# EAGLE design AP_board (EAGLE 9.2.2)
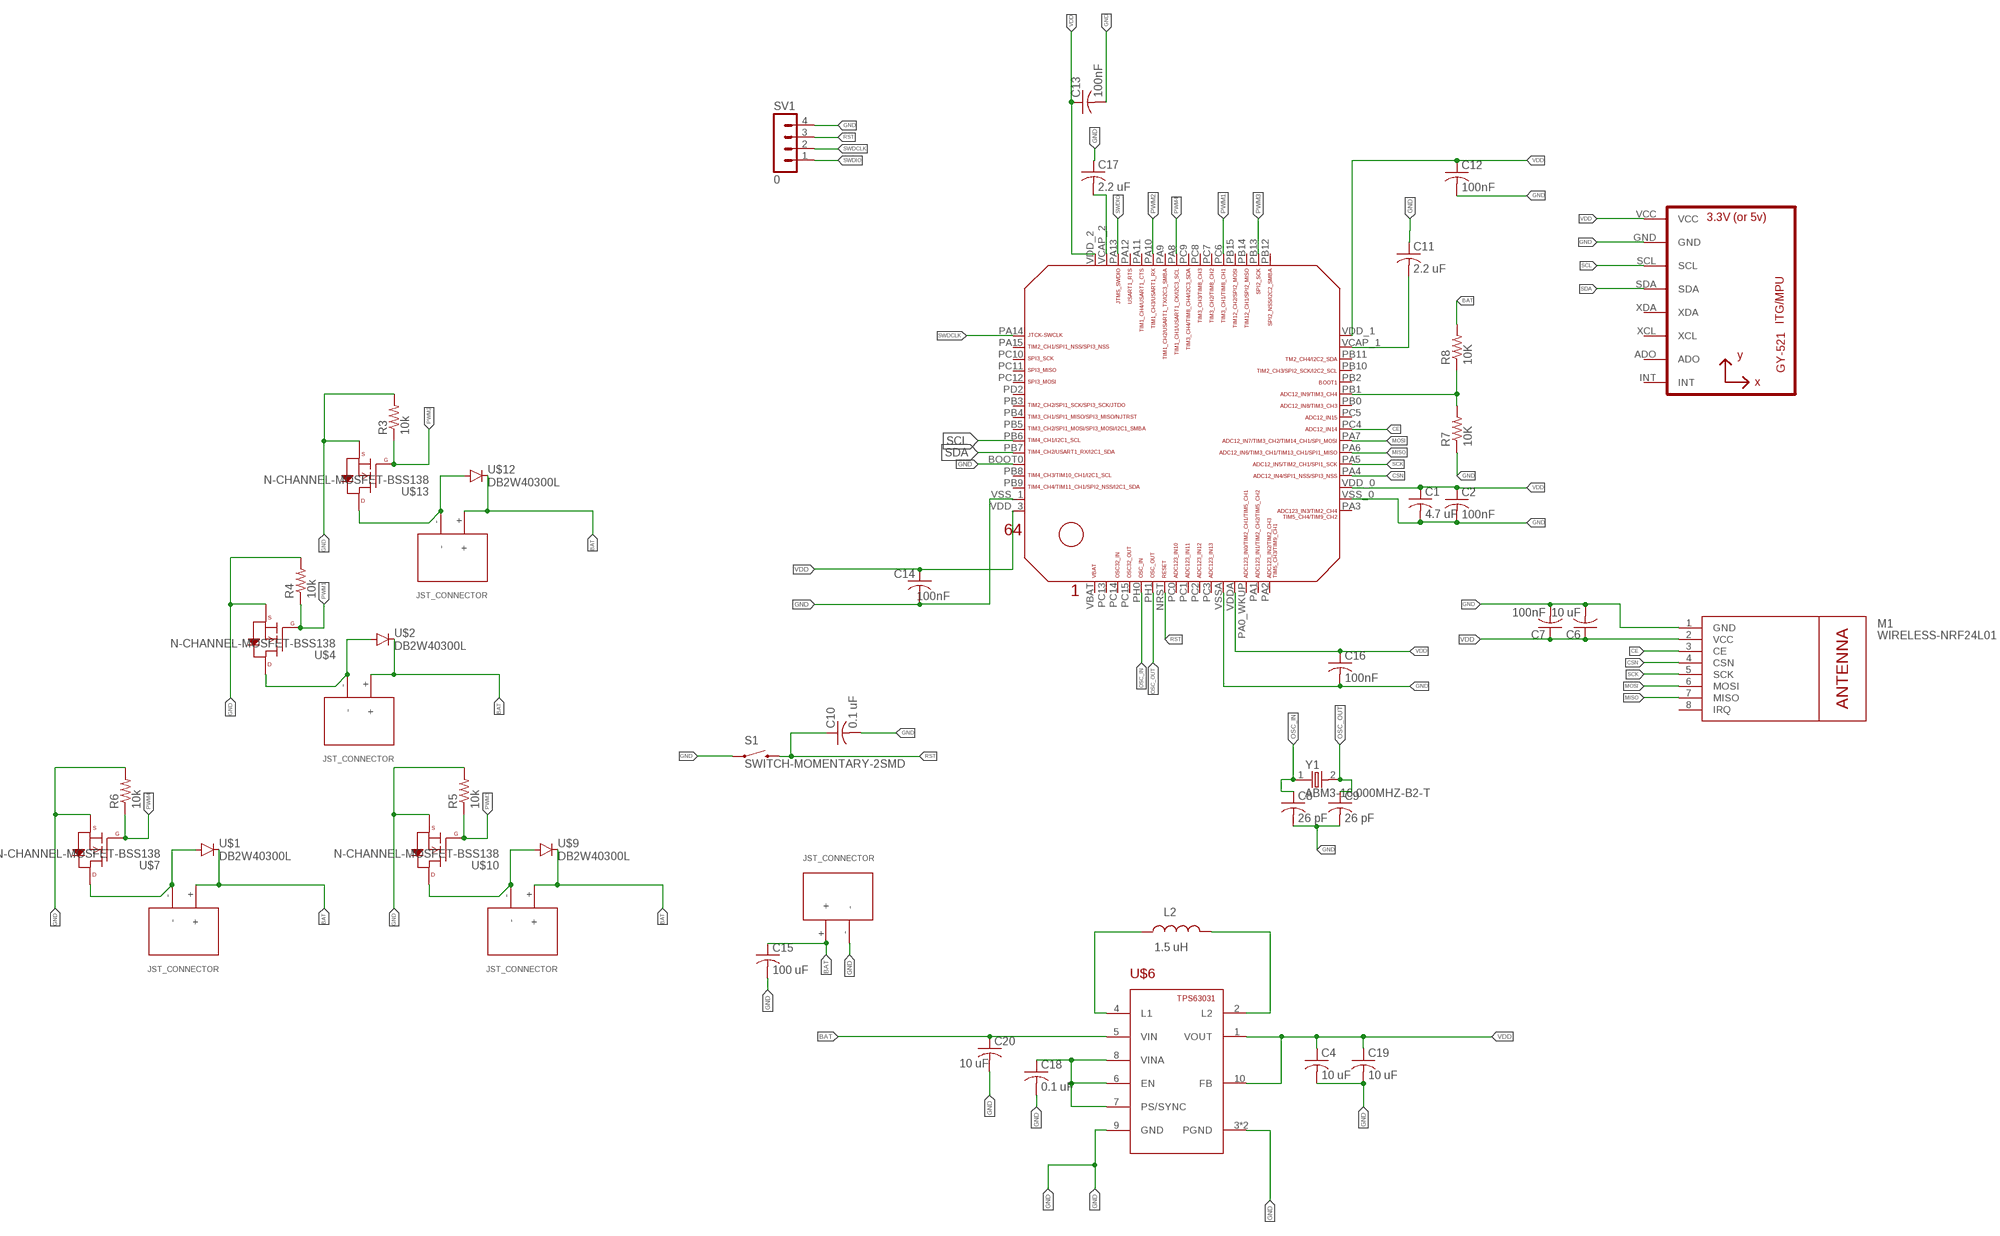
[diagram p0: schematic, sheet 1]

## Parts
C1  4.7 uF  C-USC0603  [C0603]
C2  100nF  C-USC0603  [C0603]
C4  10 uF  C-USC0603  [C0603]
C6  10 uF  C-USC0603  [C0603]
C7  100nF  C-USC0603  [C0603]
C8  26 pF  C-USC0603  [C0603]
C9  26 pF  C-USC0603  [C0603]
C10  0.1 uF  C-USC0603  [C0603]
C11  2.2 uF  C-USC0603  [C0603]
C12  100nF  C-USC0603  [C0603]
C13  100nF  C-USC0603  [C0603]
C14  100nF  C-USC0603  [C0603]
C15  100 uF  C-USC1206  [C1206]
C16  100nF  C-USC0603  [C0603]
C17  2.2 uF  C-USC0603  [C0603]
C18  0.1 uF  C-USC0603  [C0603]
C19  10 uF  C-USC0603  [C0603]
C20  10 uF  C-USC0603  [C0603]
L2  1.5 uH  INDUCTOR  [IND1212]
M1  WIRELESS-NRF24L01  [WIRELESS-NRF24L01]
R3  10k  R-US_R0603  [R0603]
R4  10k  R-US_R0603  [R0603]
R5  10k  R-US_R0603  [R0603]
R6  10k  R-US_R0603  [R0603]
R7  10K  R-US_R0603  [R0603]
R8  10K  R-US_R0603  [R0603]
S1  SWITCH-MOMENTARY-2SMD  [TACTILE-SWITCH-SMD]
SV1  0  MA04-1  [MA04-1]
U1  GY-521MPU6050  [GY-521]
U$1  DB2W40300L  [MINI2-F3-B]
U$2  DB2W40300L  [MINI2-F3-B]
U$3  STM32F405/415_LQFP64  [STM32F405/415_LQFP64]
U$4  N-CHANNEL-MOSFET-BSS138  [SOT23-3]
U$5  JST_CONNECTOR_FEMALE  [JST_CONNECTOR_FEMALE]
U$6  TPS63031  [SON-10]
U$7  N-CHANNEL-MOSFET-BSS138  [SOT23-3]
U$8  JST_CONNECTOR_FEMALE  [JST_CONNECTOR_FEMALE]
U$9  DB2W40300L  [MINI2-F3-B]
U$10  N-CHANNEL-MOSFET-BSS138  [SOT23-3]
U$11  JST_CONNECTOR_FEMALE  [JST_CONNECTOR_FEMALE]
U$12  DB2W40300L  [MINI2-F3-B]
U$13  N-CHANNEL-MOSFET-BSS138  [SOT23-3]
U$14  JST_CONNECTOR_FEMALE  [JST_CONNECTOR_FEMALE]
U$17  JST_CONNECTOR_FEMALE  [JST_CONNECTOR_FEMALE]
Y1  ABM3-16.000MHZ-B2-T  [XTAL500X320X130N]

## Nets
BAT: C15.1 C20.1 R8.2 U$1.NEG(GPIN) U$2.NEG(GPIN) U$5.+ U$6.5(VIN) U$8.+ U$9.NEG(GPIN) U$11.+ U$12.NEG(GPIN) U$14.+ U$17.+
CE: M1.3(CE) U$3.PC4
CSN: M1.4(CSN) U$3.PA4
GND: C1.2 C2.2 C4.2 C6.2 C7.2 C8.2 C9.2 C10.2 C11.1 C12.2 C13.2 C14.2 C15.2 C16.2 C17.1 C18.2 C19.2 C20.2 M1.1(GND) R3.2 R4.2 R5.2 R6.2 R7.1 S1.1 SV1.4 U1.GND U$3.BOOT0 U$3.VSS_0 U$3.VSS_1 U$3.VSSA U$4.2(S) U$6.3(PGND) U$6.9(GND) U$6.PAD(PGND) U$7.2(S) U$10.2(S) U$13.2(S) U$17.-
L3: L2.P$1 U$6.4(L1)
L4: L2.P$2 U$6.2(L2)
MISO: M1.7(MISO) U$3.PA6
MOSI: M1.6(MOSI) U$3.PA7
N$2: U$2.POS(PPIN) U$4.3(D) U$5.-
N$3: U$1.POS(PPIN) U$7.3(D) U$8.-
N$5: U$9.POS(PPIN) U$10.3(D) U$11.-
N$6: U$12.POS(PPIN) U$13.3(D) U$14.-
N$7: C11.2 U$3.VCAP_1
N$8: R7.2 R8.1 U$3.PB1
N$9: C17.2 U$3.VCAP_2
N$12: C18.1 U$6.6(EN) U$6.7(PS/SYNC) U$6.8(VINA)
OSC_IN: C8.1 U$3.PH0 Y1.1
OSC_OUT: C9.1 U$3.PH1 Y1.2
PWM1: R4.1 U$3.PC6 U$4.1(G)
PWM2: R3.1 U$3.PA10 U$13.1(G)
PWM3: R5.1 U$3.PB13 U$10.1(G)
PWM4: R6.1 U$3.PA8 U$7.1(G)
RST: C10.1 S1.3 SV1.3 U$3.NRST
SCK: M1.5(SCK) U$3.PA5
SCL: U1.SCL U$3.PB6
SDA: U1.SDA U$3.PB7
SWDCLK: SV1.2 U$3.PA14
SWDIO: SV1.1 U$3.PA13
VDD: C1.1 C2.1 C4.1 C6.1 C7.1 C12.1 C13.1 C14.1 C16.1 C19.1 M1.2(VCC) U1.VCC U$3.VDD_0 U$3.VDD_1 U$3.VDD_2 U$3.VDD_3 U$3.VDDA U$6.1(VOUT) U$6.10(FB)
Unconnected: M1.8(IRQ) U1.ADO U1.INT U1.XCL U1.XDA U$3.PA0_WKUP(PA0_AKUP) U$3.PA1 U$3.PA2 U$3.PA3 U$3.PA9 U$3.PA11 U$3.PA12 U$3.PA15 U$3.PB0 U$3.PB2 U$3.PB3 U$3.PB4 U$3.PB5 U$3.PB8 U$3.PB9 U$3.PB10 U$3.PB11 U$3.PB12 U$3.PB14 U$3.PB15 U$3.PC0 U$3.PC1 U$3.PC2 U$3.PC3 U$3.PC5 U$3.PC7 U$3.PC8 U$3.PC9 U$3.PC10 U$3.PC11 U$3.PC12 U$3.PC13 U$3.PC14 U$3.PC15 U$3.PD2 U$3.VBAT

## Library data of the parts
C1 C2 C4 C6-C20 = rcl:C-US: CAPACITOR, American symbol; SPICEPREFIX: C
L2 = Capstone Library:INDUCTOR: Inductors Basic Inductor/Choke - 0603 and 1206. Footprints are not proven and vary greatly between part numbers. INDUCTOR POWER 3.3UH 4.0A SMD 0.197" L x 0.197" W x 0.177" H (5.00mm x 5.00mm x 4.50mm)
M1 = AP_quad:WIRELESS-NRF24L01: 2.4 GHz Wireless Module based on NRF24L01 chip
R3-R8 = rcl:R-US_: RESISTOR, American symbol; SPICEPREFIX: R
S1 = AP_quad:SWITCH-MOMENTARY-2: Various NO switches- pushbuttons, reed, etc; PROD_ID: SWCH-08247
SV1 = con-lstb:MA04-1: PIN HEADER; OC_FARNELL: unknown; OC_NEWARK: unknown
U1 = AP_quad:GY-521
U$1 U$2 U$9 U$12 = AP_quad:DB2W40300L
U$3 = AP_quad:STM32F405/415_LQFP64
U$4 U$7 U$10 U$13 = AP_quad:N-CHANNEL-MOSFET: N-Channel MOSFET Mode Field Effect Transistor; DATASHEET: http://www.fairchildsemi.com/ds/BS/BSS138.pdf; DIGIKEY: BSS138TR-ND; ELEMENT14: 2323154; URL: http://au.element14.com/fairchild-semiconductor/bss138/mosfet-n-ch-50v-220ma-sot-23/dp/2323154
U$5 U$8 U$11 U$14 U$17 = AP_quad:JST_CONNECTOR_FEMALE
U$6 = Capstone Library:TPS63031
Y1 = ABM3-16.000MHZ-B2-T:ABM3-16.000MHZ-B2-T: Crystals 12MHz 18pF 30ppm -40C +85C; DESCRIPTION: Crystal 16MHz Ø·Â¢Ø¢Â±20ppm _Tol_ Ø·Â¢Ø¢Â±50ppm _Stability_ 18pF FUND 50Ohm 2-Pin CSMD T/R; DIGI-KEY_PART_NUMBER: 535-9103-1-ND; DIGI-KEY_PURCHASE_URL: https://www.digikey.com/product-detail/en/abracon-llc/ABM3-16.000MHZ-B2-T/535-9103-1-ND/675620?utm_source=snapeda&utm_medium=aggregator&utm_campaign=symbol; MF: Abracon; MP: ABM3-16.000MHZ-B2-T; PACKAGE: SMD-2 Abracon

## Board
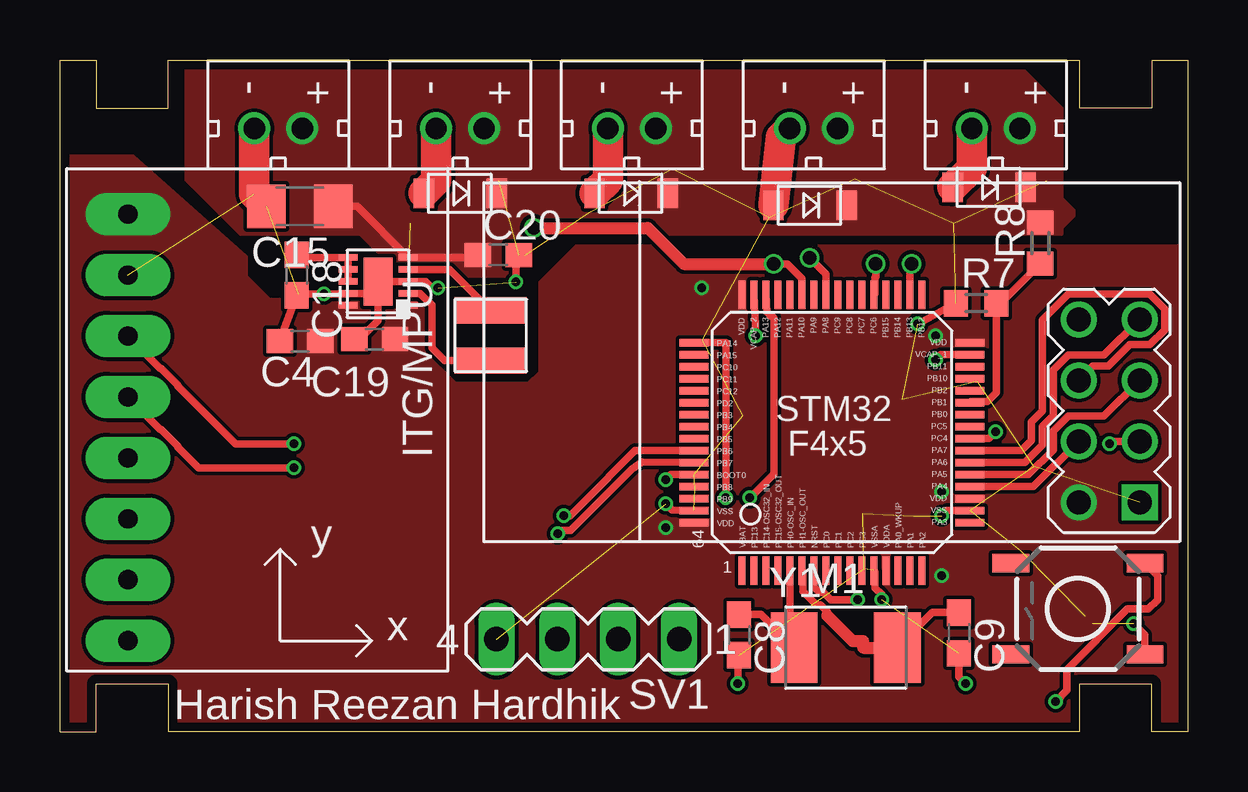
[diagram p1: board, top side]
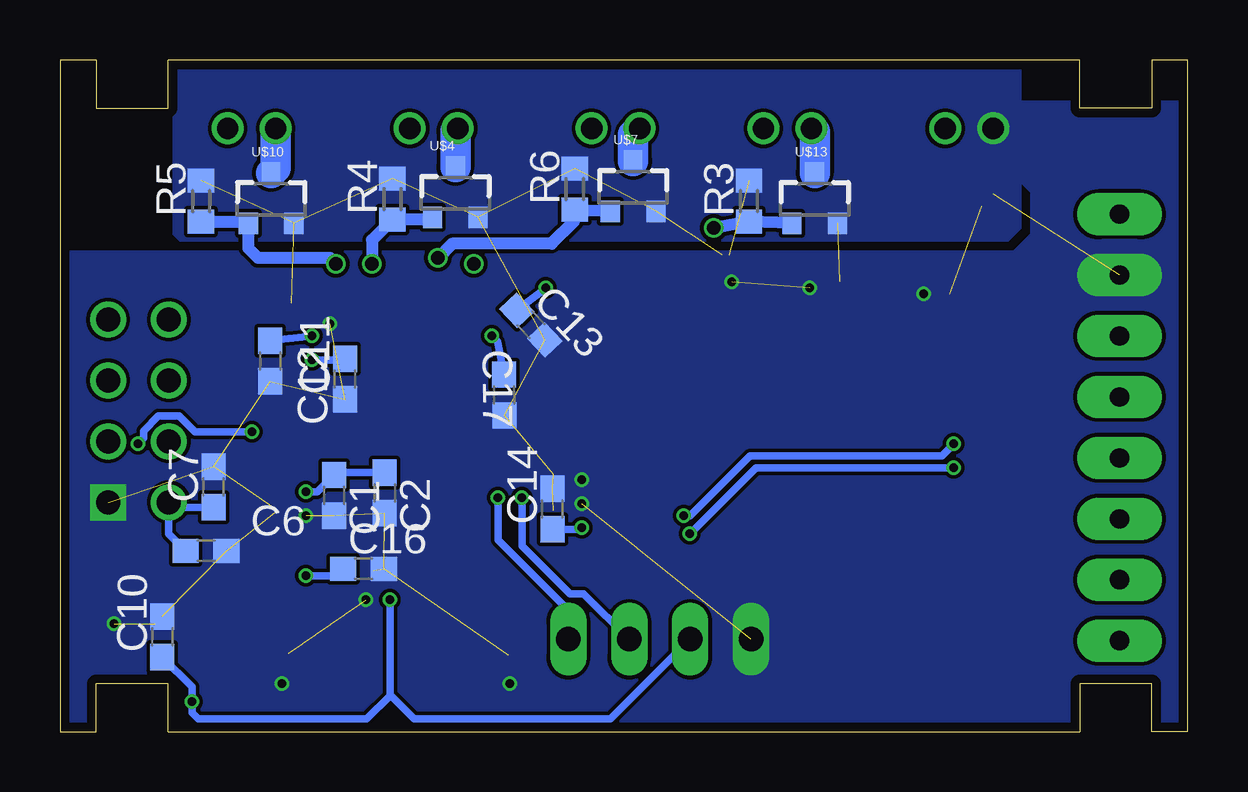
[diagram p2: board, bottom side, seen from below]

Size 47 x 28 mm. Coordinates in mm from the lower left corner, seen from the top.
Outline: 0,0 0,28 1.5,28 1.5,26 4.5,26 4.5,28 42.5,28 42.5,26 45.5,26 45.5,28 47,28 47,0 45.5,0 45.5,2 42.5,2 42.5,0 4.5,0 4.5,2 1.5,2 1.5,0 0,0
Copper layers (1*16): Top 0.035559375mm / dielectric 1.6mm / Bottom 0.035559375mm
Design rules "oshpark-2layer": minimum track width 6mil, minimum drill 10mil, track to track 6mil, track to pad 6mil, pad to pad 6mil, via to via 6mil, smd to smd 6mil, copper to edge 15mil, drill to drill 6mil, minimum pad ring 5mil, minimum via ring 5mil, stop-mask expansion 2.5mil, vias tented up to drill 0mil, thermal gap 10mil

### Footprints (pad centres in the part's own frame; a part is rotated, then mirrored left to right if it is on the bottom)
C0603 = smd 1.1 x 1: 1 -0.85,0; 2 0.85,0
C1206 = smd 1.6 x 1.8: 1 -1.4,0; 2 1.4,0
IND1212 = smd 1.1 x 3: P$1 -1.05,0; P$2 1.05,0
WIRELESS-NRF24L01 = drill 1 square: 1 -12.7,6.35 | drill 1: 2 -10.16,6.35; 3 -12.7,3.81; 4 -10.16,3.81; 5 -12.7,1.27; 6 -10.16,1.27; 7 -12.7,-1.27; 8 -10.16,-1.27
R0603 = smd 1 x 1.1: 1 -0.85,0; 2 0.85,0
TACTILE-SWITCH-SMD = smd 1.524 x 0.762: 1 -2.794,1.905; 2 2.794,1.905; 3 -2.794,-1.905; 4 2.794,-1.905
MA04-1 = drill 1.016 long: 1 -3.81,0; 2 -1.27,0; 3 1.27,0; 4 3.81,0
GY-521 = drill 0.8 pad 1.778 long: ADO -8.89,-6.35; GND -8.89,6.35; INT -8.89,-8.89; SCL -8.89,3.81; SDA -8.89,1.27; VCC -8.89,8.89; XCL -8.89,-3.81; XDA -8.89,-1.27
MINI2-F3-B = smd 1.22 x 0.85: NEG 0,1.55; POS 0,-1.5
STM32F405/415_LQFP64 = smd 1.2 x 0.3: BOOT0 -5.75,-1.75; PA3 5.75,-3.75; PA4 5.75,-2.25; PA5 5.75,-1.75; PA6 5.75,-1.25; PA7 5.75,-0.75; PA14 -5.75,3.75; PA15 -5.75,3.25; PB0 5.75,0.75; PB1 5.75,1.25; PB2 5.75,1.75; PB3 -5.75,0.75; PB4 -5.75,0.25; PB5 -5.75,-0.25; PB6 -5.75,-0.75; PB7 -5.75,-1.25; PB8 -5.75,-2.25; PB9 -5.75,-2.75; PB10 5.75,2.25; PB11 5.75,2.75; PC4 5.75,-0.25; PC5 5.75,0.25; PC10 -5.75,2.75; PC11 -5.75,2.25; PC12 -5.75,1.75; PD2 -5.75,1.25; VCAP_1 5.75,3.25; VDD_0 5.75,-2.75; VDD_1 5.75,3.75; VDD_3 -5.75,-3.75; VSS_0 5.75,-3.25; VSS_1 -5.75,-3.25 | smd 0.3 x 1.2: NRST -0.75,-5.75; PA0_WKUP 2.75,-5.75; PA1 3.25,-5.75; PA2 3.75,-5.75; PA8 -0.25,5.75; PA9 -0.75,5.75; PA10 -1.25,5.75; PA11 -1.75,5.75; PA12 -2.25,5.75; PA13 -2.75,5.75; PB12 3.75,5.75; PB13 3.25,5.75; PB14 2.75,5.75; PB15 2.25,5.75; PC0 -0.25,-5.75; PC1 0.25,-5.75; PC2 0.75,-5.75; PC3 1.25,-5.75; PC6 1.75,5.75; PC7 1.25,5.75; PC8 0.75,5.75; PC9 0.25,5.75; PC13 -3.25,-5.75; PC14 -2.75,-5.75; PC15 -2.25,-5.75; PH0 -1.75,-5.75; PH1 -1.25,-5.75; VBAT -3.75,-5.75; VCAP_2 -3.25,5.75; VDD_2 -3.75,5.75; VDDA 2.25,-5.75; VSSA 1.75,-5.75
SOT23-3 = smd 0.8 x 0.9: 1 -0.95,-1; 2 0.95,-1; 3 0,1.1
JST_CONNECTOR_FEMALE = drill 0.889: + 0,1; - 0,-1
SON-10 = smd 0.28 x 0.8: 1 -1,-1.25; 2 -0.5,-1.25; 3 0,-1.25; 4 0.5,-1.25; 5 1,-1.25; 6 1,1.25; 7 0.5,1.25; 8 0,1.25; 9 -0.5,1.25; 10 -1,1.25 | smd 2 x 1.2: PAD 0,0
XTAL500X320X130N = smd 1.95 x 2.95: 1 -2.15,0; 2 2.15,0

### Placement (x,y rotation side)
C1  35.58,9.85 270 bottom
C2  33.47,9.95 270 bottom
C4  10.01,16.28 180 top
C6  40.91,7.53 0 bottom
C7  40.6,10.2 90 bottom
C8  28.31,4.03 270 top
C9  37.47,4.11 270 top
C10  42.73,3.95 90 bottom
C11  35.11,14.7 90 bottom
C12  38.24,15.45 270 bottom
C13  27.37,16.95 313.4 bottom
C14  26.47,9.28 90 bottom
C15  10,21.9 180 top
C16  34.35,6.78 0 bottom
C17  28.48,14.03 90.7 bottom
C18  9.86,19.03 270 top
C19  13.12,16.36 180 top
C20  18.27,19.86 0 top
L2  17.95,16.52 270 top
M1  32.3,15.91 180 top
R3  18.28,22.11 90 bottom
R4  33.14,22.2 90 bottom
R5  41.12,22.11 90 bottom
R6  25.54,22.61 90 bottom
R7  38.19,17.86 0 top
R8  40.86,20.36 90 top
S1  42.43,5.12 180 top
SV1  22,3.85 180 top
U1  11.72,12.68 0 top
U$1  23.78,22.44 270 top
U$2  31.24,21.94 270 top
U$3  32.18,12.46 0 top
U$4  30.52,22.44 0 bottom
U$5  31.42,25.15 270 top
U$6  13.26,18.77 90 top
U$7  23.11,22.69 0 bottom
U$8  23.84,25.15 270 top
U$9  38.7,22.69 270 top
U$10  38.2,22.19 0 bottom
U$11  39.01,25.15 270 top
U$12  16.66,22.44 270 top
U$13  15.54,22.19 0 bottom
U$14  16.68,25.15 270 top
U$17  9.1,25.15 270 top
Y1  32.75,3.5 0 top

### Tracks (layer width: path | path; a pad name or v marks a point on that pad's centre or on a via)
BAT
  Top 0.305: C20.1 17.33,19.77 U$6.5 12.38,21.9 C15.1
  pour Top (no thermals): 6,30.25 5.25,29.5 5.25,23 7.5,20.75 12.5,20.75 14.25,19 19.75,19 21.5,20.75 41.75,20.75 41.75,21 42.25,21.5 42.25,21.75 41.75,22.25 41.75,26 37.5,30.25
CE  (via drill 0.35)
  Top 0.305: U$3.PC4 38.71,12.21 v39,12.5 | M1.3 43.85,12.1 v43.75,12
  Bottom 0.305: v43.75,12 43.52,12.23 43.52,12.54 42.9,13.15 42.02,13.15 41.37,12.5 v39,12.5
CSN
  Top 0.305: M1.4 40.57,10.21 U$3.PA4
GND  (via drill 0.35)  (32 unrouted)
  Top 0.305: U$6.PAD U$6.3 15.23,18.77 15.5,18.5 v15.75,18.5 | U$6.PAD 12.76,18.27 U$6.9 12.01,18.25 v11,18.25 9.93,18.25 C18.2 C4.2 | 19.39,19.86 C20.2 19,19.74 v19,18.75 | U$6.PAD 12.96,18.48 | 37.71,9.21 U$3.VSS_0 36.96,9.21 v36.75,9 | v44.75,4.5 45.22,4.03 S1.1 | C8.2 28.25,3.12 v28.25,2 | C9.2 37.47,2.28 v37.75,2 | R7.1 v35.75,17 | U$3.VSS_1 25.5,9.25 v25.25,9.5 | U$3.VSSA 33.98,6.67 33.98,5.98 34.25,5.71 v34.25,5.5 | U$3.BOOT0 25.46,10.71 v25.25,10.5 | U$6.PAD 13.26,17.13 12.49,16.36 C19.2
  Top 1.27: C15.2 8.1,22.4 U$17.-
  Bottom 0.305: C10.2 43.03,4.5
  pour Bottom (no thermals): 7,29.5 7,21 7.5,20.5 42,20.5 42.25,20.75 42.25,30.25 7.75,30.25
  pour Bottom (no thermals): -0.5,26.25 8.5,26.25 9.25,25.5 9.25,23.75 8.5,23 7,23 6.5,22.5 6.5,20.75 7.25,20 48.75,20 48.75,-1.5 1.25,-1.5 -2,1.75 -2,24.75
L3
  Top 0.305: L2.P$1 17.93,17.57 16.23,19.27 U$6.4
L4
  Top 0.305: U$6.2 15.01,18.27 15.5,17.78 15.5,16 16.03,15.47 L2.P$2
MISO
  Top 0.305: M1.7 43.52,15.7 42.02,15.7 41.41,15.08 41.41,13.18 40.95,12.73 40.95,11.95 40.21,11.21 U$3.PA6
MOSI
  Top 0.305: M1.6 43.06,15.24 43.7,15.24 44.59,16.12 45.44,16.12 46.05,16.74 46.05,17.62 45.44,18.23 42.02,18.23 40.95,17.16 40.95,13.37 40.49,12.92 40.49,12.14 40.06,11.71 U$3.PA7
N$2
  Top 1.27: U$5.- 30.04,24.77 U$2.POS
  Bottom 1.27: U$5.- 30.52,25.05 U$4.3
N$3
  Top 1.27: U$8.- 22.84,23 U$1.POS
  Bottom 1.27: U$7.3 23.11,24.88 U$8.-
N$5
  Top 1.27: U$11.- 38.01,23.5 U$9.POS
  Bottom 1.27: U$11.- 38.01,23.48 U$10.3
N$6
  Top 1.27: U$14.- 15.68,22.96 U$12.POS
  Bottom 1.27: U$14.- | U$14.- 15.54,25.01 U$13.3
N$7  (via drill 0.35)
  Top 0.305: U$3.VCAP_1 36.71,15.71 v36.5,15.5
  Bottom 0.305: C11.2 35.16,15.5 v36.5,15.5
N$8
  Top 0.305: R8.1 39.21,17.86 R7.2 39.04,14.14 38.66,13.76 37.98,13.76 U$3.PB1
N$9  (via drill 0.35)
  Top 0.305: U$3.VCAP_2 v29,16.5
  Bottom 0.305: v29,16.5 28.75,16.25 C17.2
N$12
  Top 0.305: U$6.8 U$6.7 U$6.6 9.97,19.77 C18.1
OSC_IN
  Top 0.305: C8.1 29.22,4.88 Y1.1 30.43,3.67 U$3.PH0
OSC_OUT
  Top 0.305: Y1.2 36.36,4.96 C9.1 | U$3.PH1 30.97,6.67 30.97,5.84 31.53,5.28 31.7,5.28 31.98,5 31.98,4.83
  Top 0.508: Y1.2 33.48,3.5 33.48,3.77 33.04,3.77 31.98,4.83
PWM1  (via drill 0.55)
  Top 0.305: U$3.PC6 33.98,18.25 33.98,18.94 34,18.96 v34,19.5
  Bottom 0.508: U$4.1 31.56,21.35 R4.1 34,20.49 v34,19.5
PWM2  (via drill 0.55)
  Top 0.305: U$3.PA10 30.93,18.89 30.32,19.5 v29.75,19.5
  Top 0.508: v19.75,21 24.5,21 26,19.5 v29.75,19.5
  Bottom 0.508: U$13.1 R3.1 v19.75,21
PWM3  (via drill 0.55)
  Top 0.305: U$3.PB13 35.43,19.43 v35.5,19.5
  Bottom 0.508: R5.1 39.22,21.26 U$10.1 39.15,20.15 38.75,19.75 35.75,19.75 v35.5,19.5
PWM4  (via drill 0.55)
  Top 0.305: U$3.PA8 31.93,19.07 v31.25,19.75
  Bottom 0.508: R6.1 25.58,21.73 | 25.58,21.73 25.58,21.26 26.5,20.33 30.67,20.33 v31.25,19.75 | U$7.1 25.58,21.73
RST  (via drill 0.35)
  Top 0.305: v33.25,5.5 32.13,5.5 31.82,5.8 31.65,5.8 31.43,6.03 U$3.NRST | S1.3 45.75,6.5 45.75,5.5 45.36,5.11 44.5,5.11 41.97,2.58 41.97,1.72 v41.5,1.25
  Bottom 0.305: SV1.3 24.05,0.53 32.25,0.53 33.25,1.53 | v33.25,5.5 33.25,1.53 | 33.25,1.53 33.25,1.5 34.22,0.53 41.25,0.53 41.5,0.78 v41.5,1.25 41.5,1.87 C10.1
SCK
  Top 0.305: M1.5 43.52,13.15 42.02,13.15 41.41,12.54 41.41,11.75 40.37,10.71 U$3.PA5
SCL  (via drill 0.35)
  Top 0.305: v9.75,12 7.32,12 4.91,14.41 4.91,14.44 4.21,15.14 4.18,15.14 U1.SCL | U$3.PB6 23.96,11.71 21.75,9.5 21.25,9 v21,9
  Bottom 0.305: v9.75,12 10.25,11.5 18.25,11.5 20.75,9 v21,9
SDA  (via drill 0.35)
  Top 0.305: v9.75,11 5.78,11 4.91,11.87 4.91,11.9 4.21,12.6 4.18,12.6 U1.SDA | v20.75,8.25 20.89,8.39 21.29,8.39 23.82,10.93 24.25,11.25 U$3.PB7
  Bottom 0.305: v9.75,11 18,11 v20.75,8.25
SWDCLK  (via drill 0.35)
  Top 0.305: v27.75,9.75 27.75,16.21 U$3.PA14
  Bottom 0.305: SV1.2 25.17,5.75 25.75,5.75 27.75,7.75 v27.75,9.75
SWDIO  (via drill 0.35)
  Top 0.305: U$3.PA13 29.48,17.5 29.48,17.48 29.65,17.3 29.7,17.3 29.75,17.25 29.75,10.75 v28.75,9.75
  Bottom 0.305: SV1.1 25.81,5.06 28.75,8 v28.75,9.75
VDD  (via drill 0.35)
  Top 0.305: C19.1 14.25,16.08 | U$6.10 11.99,17.75 | 10.75,16.17 C4.1
  Bottom 0.305: C13.1 v26.75,18.5 | v36.75,10 36.28,10 C1.1 35.48,10.8 C2.1 | v36.75,6.5 35.69,6.5 C16.1 | C14.1 25.32,8.43 v25.25,8.5 | C6.1 42.46,8.23 M1.2 42.25,9.35 C7.1 | C12.1 v36.5,16.5
  pour Top (no thermals): 0.21,24 3.04,24 7.75,19.81 7.75,18.99 8.74,18 14.98,18.02 15.25,17.75 15.25,15.75 16.5,14.5 19.52,14.52 20,15 20,18.75 21.5,20.25 47,20.25 48.25,19 48.25,-0.75 49.4,-1.9 0.21,-1.9

### Text on the board
tPlace: Harish Reezan Hardhik